# EAGLE design Applied-Procrastination-Fetch-Driver-Circuit-v1r2 (EAGLE 9.2.2)
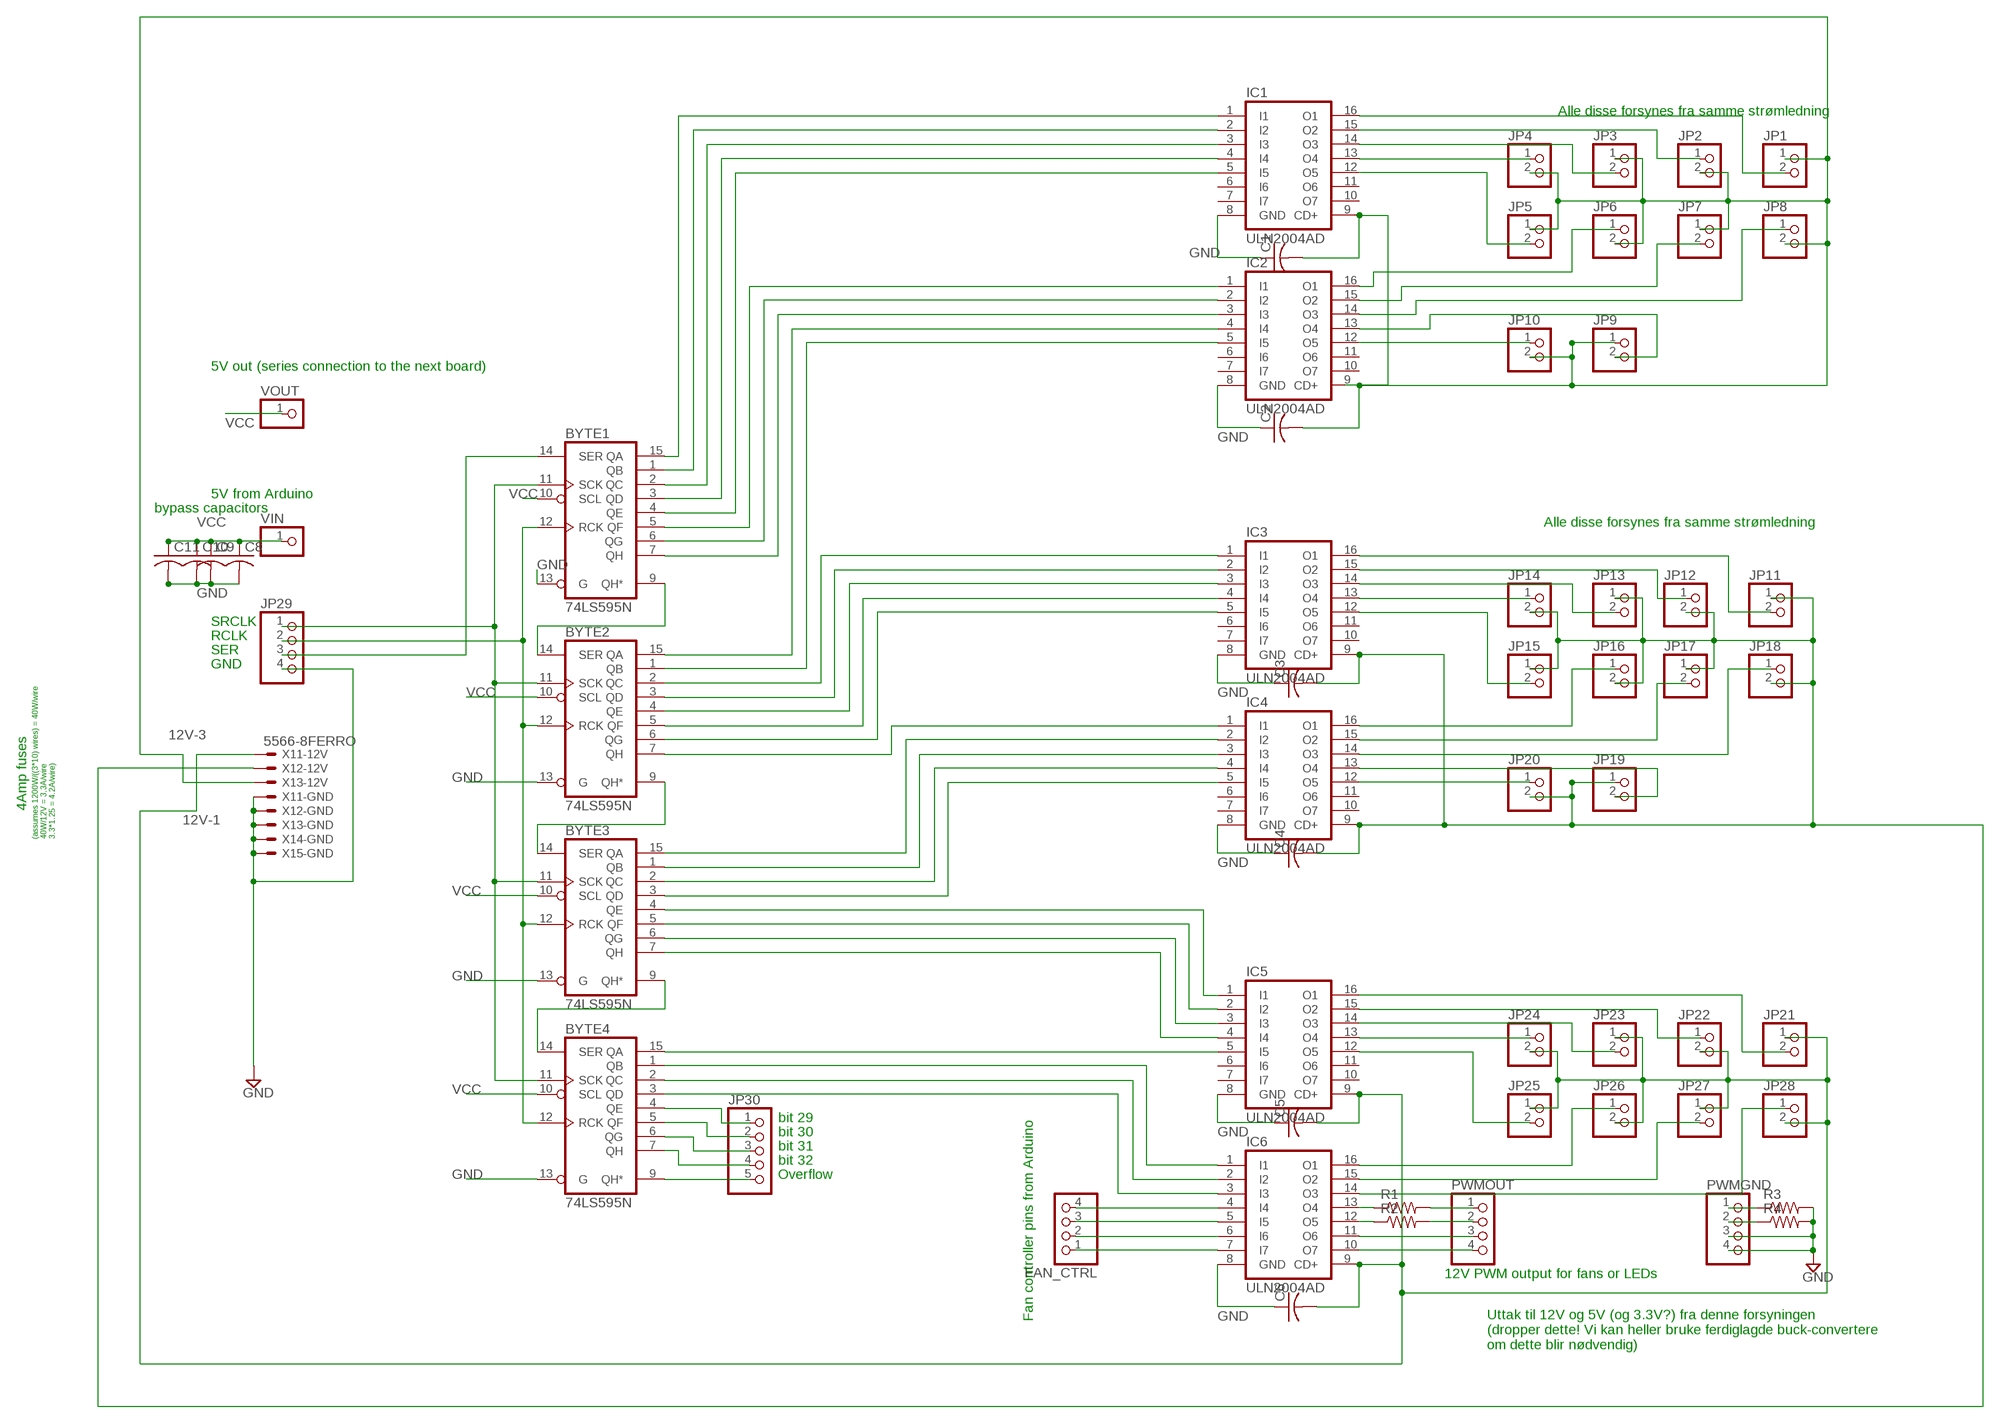
[diagram p0: schematic, sheet 1]

## Parts
BYTE1  74LS595N  [DIL16]
BYTE2  74LS595N  [DIL16]
BYTE3  74LS595N  [DIL16]
BYTE4  74LS595N  [DIL16]
C1  C-USC0603  [C0603]
C2  C-USC0603  [C0603]
C3  C-USC0603  [C0603]
C4  C-USC0603  [C0603]
C5  C-USC0603  [C0603]
C6  C-USC0603  [C0603]
C8  C-USC0603  [C0603]
C9  C-USC0603  [C0603]
C10  C-USC0603  [C0603]
C11  C-USC0603  [C0603]
FAN_CTRL  PINHD-1X4  [1X04]
IC1  ULN2004AD  [SO16]
IC2  ULN2004AD  [SO16]
IC3  ULN2004AD  [SO16]
IC4  ULN2004AD  [SO16]
IC5  ULN2004AD  [SO16]
IC6  ULN2004AD  [SO16]
JP1  PINHD-1X2SOLENOID-R  [SOLENOID-CONTACT-REVERSE]
JP2  PINHD-1X2SOLENOID  [SOLENOID-CONTACT]
JP3  PINHD-1X2SOLENOID-R  [SOLENOID-CONTACT-REVERSE]
JP4  PINHD-1X2SOLENOID  [SOLENOID-CONTACT]
JP5  PINHD-1X2SOLENOID-R  [SOLENOID-CONTACT-REVERSE]
JP6  PINHD-1X2SOLENOID  [SOLENOID-CONTACT]
JP7  PINHD-1X2SOLENOID-R  [SOLENOID-CONTACT-REVERSE]
JP8  PINHD-1X2SOLENOID  [SOLENOID-CONTACT]
JP9  PINHD-1X2SOLENOID-R  [SOLENOID-CONTACT-REVERSE]
JP10  PINHD-1X2SOLENOID  [SOLENOID-CONTACT]
JP11  PINHD-1X2SOLENOID-R  [SOLENOID-CONTACT-REVERSE]
JP12  PINHD-1X2SOLENOID  [SOLENOID-CONTACT]
JP13  PINHD-1X2SOLENOID-R  [SOLENOID-CONTACT-REVERSE]
JP14  PINHD-1X2SOLENOID  [SOLENOID-CONTACT]
JP15  PINHD-1X2SOLENOID-R  [SOLENOID-CONTACT-REVERSE]
JP16  PINHD-1X2SOLENOID  [SOLENOID-CONTACT]
JP17  PINHD-1X2SOLENOID-R  [SOLENOID-CONTACT-REVERSE]
JP18  PINHD-1X2SOLENOID  [SOLENOID-CONTACT]
JP19  PINHD-1X2SOLENOID-R  [SOLENOID-CONTACT-REVERSE]
JP20  PINHD-1X2SOLENOID  [SOLENOID-CONTACT]
JP21  PINHD-1X2SOLENOID-R  [SOLENOID-CONTACT-REVERSE]
JP22  PINHD-1X2SOLENOID  [SOLENOID-CONTACT]
JP23  PINHD-1X2SOLENOID-R  [SOLENOID-CONTACT-REVERSE]
JP24  PINHD-1X2SOLENOID  [SOLENOID-CONTACT]
JP25  PINHD-1X2SOLENOID-R  [SOLENOID-CONTACT-REVERSE]
JP26  PINHD-1X2SOLENOID  [SOLENOID-CONTACT]
JP27  PINHD-1X2SOLENOID-R  [SOLENOID-CONTACT-REVERSE]
JP28  PINHD-1X2SOLENOID  [SOLENOID-CONTACT]
JP29  PINHD-1X4  [1X04]
JP30  PINHD-1X5  [1X05]
PWMGND  PINHD-1X4  [1X04]
PWMOUT  PINHD-1X4  [1X04]
R1  R-US_R0603  [R0603]
R2  R-US_R0603  [R0603]
R3  R-US_R0603  [R0603]
R4  R-US_R0603  [R0603]
VIN  PINHD-1X1  [1X01]
VOUT  PINHD-1X1  [1X01]
X1  5566-8FERRO  [5566-8-CLEAN]

## Nets
12V-1: C5.2 C6.2 IC5.9(CD+) IC6.9(CD+) JP21.1 JP22.2 JP23.1 JP24.2 JP25.1 JP26.2 JP27.1 JP28.2 X1.1
12V-2: C3.2 C4.2 IC3.9(CD+) IC4.9(CD+) JP11.1 JP12.2 JP13.1 JP14.2 JP15.1 JP16.2 JP17.1 JP18.2 JP19.1 JP20.2 X1.2
12V-3: C1.2 C2.2 IC1.9(CD+) IC2.9(CD+) JP1.1 JP2.2 JP3.1 JP4.2 JP5.1 JP6.2 JP7.1 JP8.2 JP9.1 JP10.2 X1.3
GND: BYTE1.13(G) BYTE2.13(G) BYTE3.13(G) BYTE4.13(G) C1.1 C2.1 C3.1 C4.1 C5.1 C6.1 C8.2 C9.2 C10.2 C11.2 IC1.8(GND) IC2.8(GND) IC3.8(GND) IC4.8(GND) IC5.8(GND) IC6.8(GND) JP29.4 PWMGND.3 PWMGND.4 R3.2 R4.2 X1.4 X1.5 X1.6 X1.7 X1.8
N$1: BYTE1.11(SCK) BYTE2.11(SCK) BYTE3.11(SCK) BYTE4.11(SCK) JP29.1
N$2: FAN_CTRL.4 IC6.4(I4)
N$3: FAN_CTRL.3 IC6.5(I5)
N$4: FAN_CTRL.2 IC6.6(I6)
N$5: BYTE1.12(RCK) BYTE2.12(RCK) BYTE3.12(RCK) BYTE4.12(RCK) JP29.2
N$6: BYTE1.14(SER) JP29.3
N$7: BYTE1.9(QH*) BYTE2.14(SER)
N$8: BYTE2.9(QH*) BYTE3.14(SER)
N$9: BYTE3.9(QH*) BYTE4.14(SER)
N$10: BYTE1.15(QA) IC1.1(I1)
N$11: BYTE1.1(QB) IC1.2(I2)
N$12: BYTE1.2(QC) IC1.3(I3)
N$13: BYTE1.3(QD) IC1.4(I4)
N$14: BYTE1.4(QE) IC1.5(I5)
N$15: BYTE1.5(QF) IC2.1(I1)
N$16: BYTE1.6(QG) IC2.2(I2)
N$17: BYTE1.7(QH) IC2.3(I3)
N$18: BYTE2.15(QA) IC2.4(I4)
N$19: BYTE2.1(QB) IC2.5(I5)
N$20: BYTE2.2(QC) IC3.1(I1)
N$21: BYTE2.3(QD) IC3.2(I2)
N$22: BYTE2.4(QE) IC3.3(I3)
N$23: BYTE2.5(QF) IC3.4(I4)
N$24: BYTE2.6(QG) IC3.5(I5)
N$25: BYTE2.7(QH) IC4.1(I1)
N$26: BYTE3.15(QA) IC4.2(I2)
N$27: BYTE3.1(QB) IC4.3(I3)
N$28: BYTE3.2(QC) IC4.4(I4)
N$29: BYTE3.3(QD) IC4.5(I5)
N$30: BYTE3.4(QE) IC5.1(I1)
N$31: BYTE3.5(QF) IC5.2(I2)
N$32: BYTE3.6(QG) IC5.3(I3)
N$33: BYTE3.7(QH) IC5.4(I4)
N$34: BYTE4.15(QA) IC5.5(I5)
N$35: BYTE4.1(QB) IC6.1(I1)
N$36: BYTE4.2(QC) IC6.2(I2)
N$37: BYTE4.3(QD) IC6.3(I3)
N$38: BYTE4.4(QE) JP30.1
N$39: BYTE4.5(QF) JP30.2
N$40: BYTE4.6(QG) JP30.3
N$41: BYTE4.7(QH) JP30.4
N$42: BYTE4.9(QH*) JP30.5
N$43: IC1.13(O4) JP4.1
N$44: IC1.14(O3) JP3.2
N$45: IC1.15(O2) JP2.1
N$46: IC1.16(O1) JP1.2
N$47: IC1.12(O5) JP5.2
N$48: IC2.16(O1) JP6.1
N$49: IC2.15(O2) JP7.2
N$50: IC2.14(O3) JP8.1
N$51: IC2.13(O4) JP9.2
N$52: IC3.16(O1) JP11.2
N$53: IC3.13(O4) JP14.1
N$54: IC2.12(O5) JP10.1
N$55: IC3.15(O2) JP12.1
N$56: IC3.14(O3) JP13.2
N$57: IC3.12(O5) JP15.2
N$58: IC4.16(O1) JP16.1
N$59: IC4.15(O2) JP17.2
N$60: IC4.14(O3) JP18.1
N$61: IC4.13(O4) JP19.2
N$62: IC4.12(O5) JP20.1
N$63: IC5.13(O4) JP24.1
N$64: IC5.16(O1) JP21.2
N$65: IC5.15(O2) JP22.1
N$66: IC5.14(O3) JP23.2
N$67: IC5.12(O5) JP25.2
N$68: IC6.16(O1) JP26.1
N$69: IC6.15(O2) JP27.2
N$70: IC6.14(O3) JP28.1
N$71: FAN_CTRL.1 IC6.7(I7)
N$72: PWMOUT.1 R1.2
N$73: PWMOUT.2 R2.2
N$74: IC6.11(O6) PWMOUT.3
N$75: IC6.10(O7) PWMOUT.4
N$76: PWMGND.1 R3.1
N$77: PWMGND.2 R4.1
N$80: IC6.13(O4) R1.1
N$81: IC6.12(O5) R2.1
VCC: BYTE1.10(SCL) BYTE2.10(SCL) BYTE3.10(SCL) BYTE4.10(SCL) C8.1 C9.1 C10.1 C11.1 VIN.1 VOUT.1
Unconnected: IC1.6(I6) IC1.7(I7) IC1.10(O7) IC1.11(O6) IC2.6(I6) IC2.7(I7) IC2.10(O7) IC2.11(O6) IC3.6(I6) IC3.7(I7) IC3.10(O7) IC3.11(O6) IC4.6(I6) IC4.7(I7) IC4.10(O7) IC4.11(O6) IC5.6(I6) IC5.7(I7) IC5.10(O7) IC5.11(O6)

## Notes on the sheet
- Alle disse forsynes fra samme strømledning
- 5V out (series connection to the next board)
- 5V from Arduino
- bypass capacitors
- Alle disse forsynes fra samme strømledning
- SRCLK
- RCLK
- SER
- GND
- 4Amp fuses
- (assumes 1200W/((3*10) wires) = 40W/wire
  40W/12V = 3.3A/wire
  3.3*1.25 = 4.2A/wire)
- bit 29
- bit 30
- bit 31
- bit 32
- Overflow
- 12V PWM output for fans or LEDs
- Fan controller pins from Arduino
- Uttak til 12V og 5V (og 3.3V?) fra denne forsyningen 
  (dropper dette! Vi kan heller bruke ferdiglagde buck-convertere 
  om dette blir nødvendig)

## Power pins joined to a net without a drawn wire
GND: BYTE1.8(GND) BYTE2.8(GND) BYTE3.8(GND) BYTE4.8(GND)
VCC: BYTE1.16(VCC) BYTE2.16(VCC) BYTE3.16(VCC) BYTE4.16(VCC)

## Library data of the parts
BYTE1-BYTE4 = 74xx-us:74*595: 8-bit SHIFT REGISTER, output latch
C1-C6 C8-C11 = resistor:C-US: CAPACITOR, American symbol
FAN_CTRL JP29 PWMGND PWMOUT = pinhead-custom:PINHD-1X4: PIN HEADER
IC1-IC6 = uln-udn-custom:ULN2004A: DRIVER ARRAY
JP1-JP28 = pinhead-custom:PINHD-1X2: PIN HEADER
JP30 = pinhead:PINHD-1X5: PIN HEADER
R1-R4 = resistor:R-US_: RESISTOR, American symbol
VIN VOUT = pinhead-custom:PINHD-1X1: PIN HEADER
X1 = con-molex-custom:5566-8: Mini FIT connector 8 pol Source: http://www.molex.com

## Board
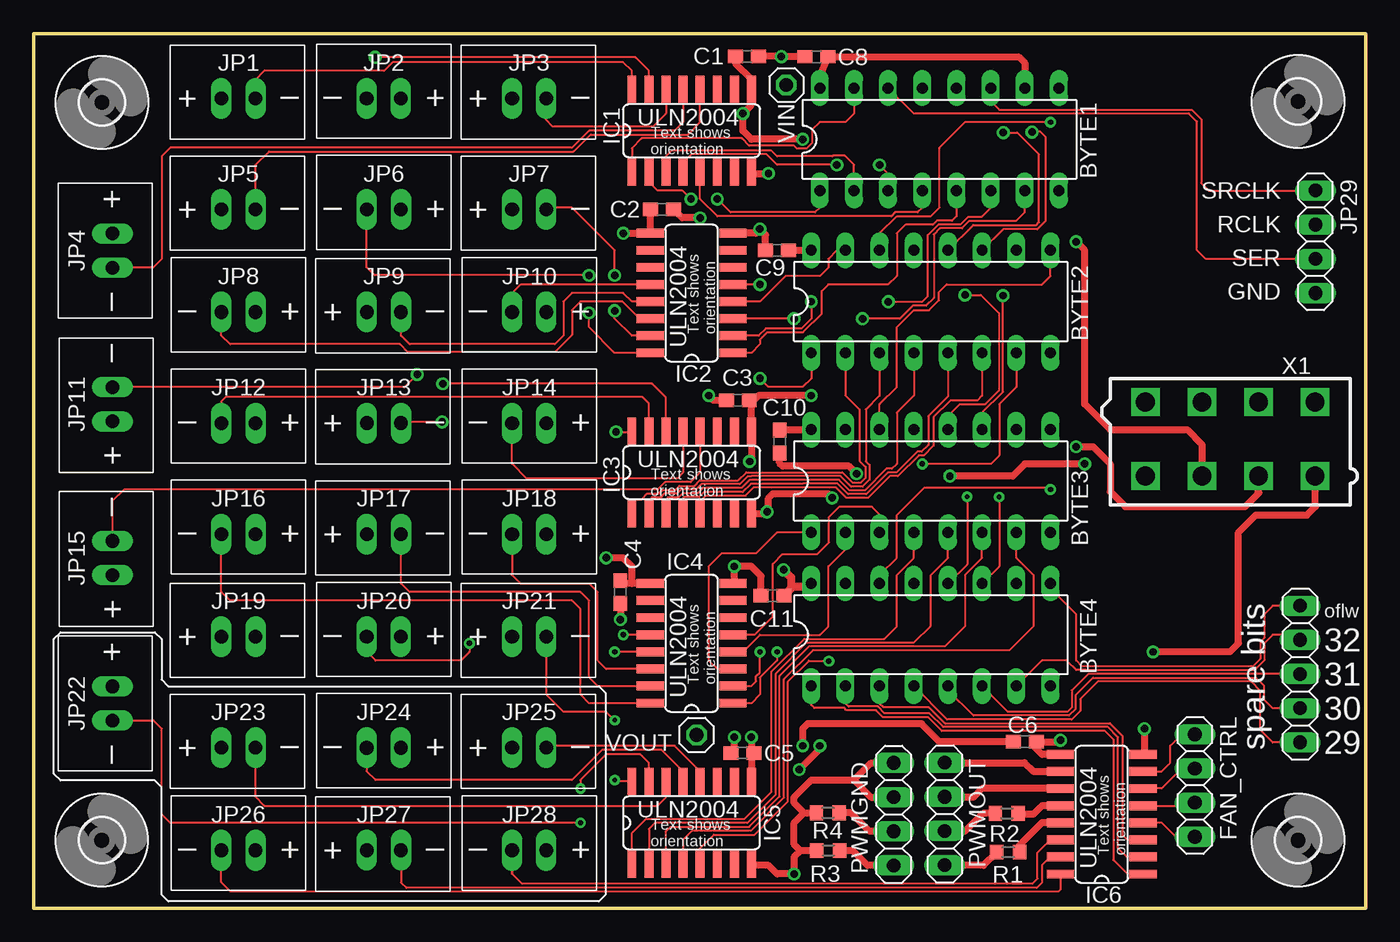
[diagram p1: board, top side]
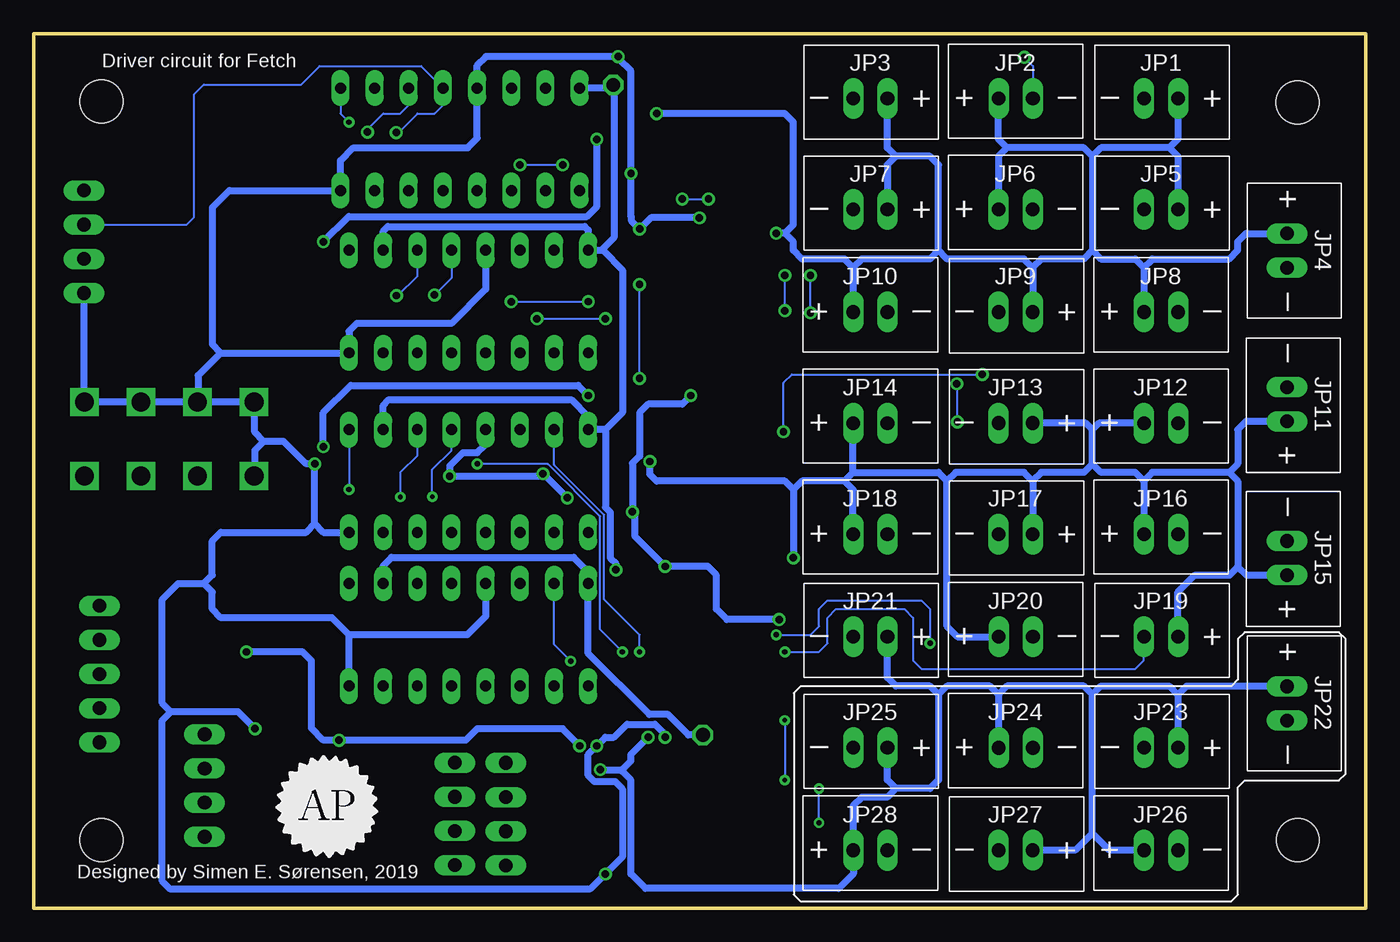
[diagram p2: board, bottom side, seen from below]

Size 99 x 65 mm. Coordinates in mm from the lower left corner, seen from the top.
Outline: 0,0 99,0 99,65 0,65 0,0
Copper layers (1*16): Top 0.035mm / dielectric 1.5mm / Bottom 0.035mm
Design rules "default *": minimum track width 5mil, minimum drill 0.35mm, track to track 5mil, track to pad 5mil, pad to pad 5mil, via to via 5mil, smd to smd 5mil, copper to edge 40mil, drill to drill 6mil, minimum pad ring 10mil, minimum via ring 8mil, stop-mask expansion 4mil, vias tented up to drill 0mil, thermal gap 10mil

### Footprints (pad centres in the part's own frame; a part is rotated, then mirrored left to right if it is on the bottom)
DIL16 = drill 0.813 long: 1 -8.89,-3.81; 2 -6.35,-3.81; 3 -3.81,-3.81; 4 -1.27,-3.81; 5 1.27,-3.81; 6 3.81,-3.81; 7 6.35,-3.81; 8 8.89,-3.81; 9 8.89,3.81; 10 6.35,3.81; 11 3.81,3.81; 12 1.27,3.81; 13 -1.27,3.81; 14 -3.81,3.81; 15 -6.35,3.81; 16 -8.89,3.81
C0603 = smd 1.1 x 1: 1 -0.85,0; 2 0.85,0
1X04 = drill 1.016 long: 1 -3.81,0; 2 -1.27,0; 3 1.27,0; 4 3.81,0
SO16 = smd 0.66 x 2.032: 1 -4.445,-3.073; 2 -3.175,-3.073; 3 -1.905,-3.073; 4 -0.635,-3.073; 5 0.635,-3.073; 6 1.905,-3.073; 7 3.175,-3.073; 8 4.445,-3.073; 9 4.445,3.073; 10 3.175,3.073; 11 1.905,3.073; 12 0.635,3.073; 13 -0.635,3.073; 14 -1.905,3.073; 15 -3.175,3.073; 16 -4.445,3.073
SOLENOID-CONTACT-REVERSE = drill 1.016 long: 1 3.8,3.035; 2 6.34,3.035
SOLENOID-CONTACT = drill 1.016 long: 1 3.788,3.031; 2 6.328,3.031
1X05 = drill 1.016 long: 1 -5.08,0; 2 -2.54,0; 3 0,0; 4 2.54,0; 5 5.08,0
R0603 = smd 1 x 1.1: 1 -0.85,0; 2 0.85,0
3,2 = hole 3.2: 0,0
1X01 = drill 1.016 octagon: 1 0,0
5566-8-CLEAN = drill 1.4 square: 1 6.325,-3.436; 2 2.125,-3.436; 3 -2.075,-3.436; 4 -6.275,-3.436; 5 6.325,2.064; 6 2.125,2.064; 7 -2.075,2.064; 8 -6.275,2.064

### Placement (x,y rotation side)
BYTE1  67.31,57.15 0 top
BYTE2  66.67,45.09 0 top
BYTE3  66.67,31.75 0 top
BYTE4  66.67,20.32 0 top
C1  53.02,63.32 180 top
C2  46.7,51.94 180 top
C3  52.33,37.74 0 top
C4  43.59,23.49 90 top
C5  52.67,11.54 0 top
C6  73.66,12.37 0 top
C8  58.18,63.28 180 top
C9  55.24,48.9 180 top
C10  55.44,34.69 270 top
C11  54.9,23.23 180 top
FAN_CTRL  86.3,9.11 270 top
IC1  48.9,57.78 0 top
IC2  48.9,45.72 90 top
IC3  48.9,32.38 0 top
IC4  48.9,19.68 90 top
IC5  48.9,6.35 0 top
IC6  79.38,6.99 90 top
JP1  10.15,57.15 0 top
JP2  20.95,57.15 0 top
JP3  31.75,57.15 0 top
JP4  8.89,43.81 90 top
JP5  10.15,48.9 0 top
JP6  20.97,48.9 0 top
JP7  31.75,48.9 0 top
JP8  10.16,41.27 0 top
JP9  20.95,41.27 0 top
JP10  31.76,41.27 0 top
JP11  8.89,32.38 90 top
JP12  10.16,33.02 0 top
JP13  20.95,33.02 0 top
JP14  31.76,33.02 0 top
JP15  8.89,20.95 90 top
JP16  10.16,24.77 0 top
JP17  20.95,24.77 0 top
JP18  31.76,24.77 0 top
JP19  10.15,17.14 0 top
JP20  20.95,17.14 0 top
JP21  31.75,17.14 0 top
JP22  8.89,10.16 90 top
JP23  10.15,8.89 0 top
JP24  20.95,8.89 0 top
JP25  31.75,8.89 0 top
JP26  10.16,1.27 0 top
JP27  20.95,1.27 0 top
JP28  31.76,1.27 0 top
JP29  95.25,49.53 270 top
JP30  94.11,17.4 90 top
PWMGND  63.91,6.99 90 top
PWMOUT  67.71,7 90 top
R1  72.42,4.17 180 top
R2  72.32,7.04 180 top
R3  59.05,4.28 180 top
R4  59.02,7.09 180 top
U$1  [3,2]  5.06,5.05 0 top
U$2  [3,2]  93.97,5.05 0 top
U$3  [3,2]  93.95,59.96 0 top
U$5  [3,2]  5.08,59.88 0 top
VIN  55.94,61.18 0 top
VOUT  49.26,12.88 90 top
X1  88.9,35.56 0 top

### Tracks (layer width: path | path; a pad name or v marks a point on that pad's centre or on a via)
12V-1  (via drill 0.55)
  Top 0.508: v53.34,12.7 53.34,11.72 C5.2 53.33,11.34 53.33,9.44 IC5.9 | v56.89,10.3 58.42,11.83 v58.42,12.06 | IC6.9 74.93,11.43 74.3,12.06 74.3,12.15 C6.2 76.2,12.37 v76.31,12.48 | v83.19,19.05 88.9,19.05 89.53,19.68 89.53,27.94 90.81,29.21 94.61,29.21 95.25,29.84 95.22,29.87 X1.1
  Bottom 0.508: JP27.1 21.59,4.3 20.32,5.58 | 20.32,5.58 20.32,15.88 | 20.32,15.88 20.95,16.51 26.67,16.51 27.3,15.88 | 31.75,15.88 31.11,16.51 27.94,16.51 27.3,15.88 | 31.75,15.88 31.75,9.53 32.38,8.89 34.92,8.89 | 34.92,8.89 35.56,9.53 35.55,9.54 JP25.1 | 34.92,8.89 35.56,8.26 37.47,8.26 38.1,7.62 JP28.2 38.09,2.55 39.17,1.47 53.54,1.47 54.61,2.54 54.61,9.53 55.24,10.16 55.24,10.29 55.26,10.3 | 27.3,15.88 27.3,11.94 JP24.2 | 20.32,15.88 19.68,16.51 14.61,16.51 13.96,15.87 | 13.96,15.87 JP23.1 | 13.96,15.87 13.34,16.49 13.34,16.51 5.88,16.51 JP22.2 | 31.75,15.88 32.38,16.51 34.92,16.51 35.56,17.14 JP21.1 | v53.34,12.7 54.61,11.43 54.61,10.95 55.26,10.3 | v56.89,10.3 55.26,10.3 | v58.42,12.06 59.69,13.34 66.04,13.34 66.9,12.48 v76.31,12.48 77.47,12.48 78.36,13.37 78.36,18.38 79.05,19.07 83.16,19.07 v83.19,19.05 | JP26.2 19.05,4.3 20.32,5.58
12V-2  (via drill 0.55)
  Top 0.508: v53.2,33.2 53.34,33.34 IC3.9 53.34,37.59 | C4.2 43.8,24.13 44.45,24.13 | IC4.9 44.45,24.13 | 44.45,24.13 44.45,25.4 43.81,26.04 v42.55,26.04 | 53.34,37.59 C3.2 | v57.78,38.1 53.85,38.1 53.34,37.59 | v77.47,34.29 78.74,34.29 80.01,33.02 80.01,30.96 81.12,29.84 90.02,29.84 91.05,30.87 91.03,30.89 X1.2
  Bottom 0.508: JP11.1 8.88,36.19 8.89,36.2 9.53,35.56 9.53,33.02 10.16,32.38 | 10.16,32.38 9.53,31.75 9.53,25.4 9.5,25.38 | JP15.1 8.88,24.75 9.5,25.38 | 10.16,32.38 15.88,32.38 16.51,31.75 | 16.51,31.75 16.49,31.73 JP16.2 | JP16.2 | 16.51,31.75 17.14,32.38 19.68,32.38 20.32,33.02 | 20.32,33.02 20.32,35.56 | 20.32,35.56 20.82,36.05 JP13.1 | 20.32,33.02 20.95,32.38 24.13,32.38 24.77,31.75 | 24.77,31.75 24.75,31.74 JP17.1 | 24.77,31.75 25.4,32.38 30.48,32.38 31.11,31.75 | 31.11,31.75 31.75,32.38 38.1,32.38 | 38.1,36.03 38.08,36.05 | 38.1,27.82 38.1,31.11 38.73,31.75 | 38.1,27.82 38.08,27.8 | JP20.2 30.34,20.18 31.11,20.95 31.11,31.75 | JP19.1 13.96,22.85 13.97,22.86 13.97,23.5 12.7,24.77 10.12,24.77 9.5,25.38 | 42.55,31.11 41.91,31.75 38.73,31.75 | 42.55,31.11 v42.55,26.04 | 38.73,31.75 38.1,32.38 | 38.1,32.38 38.1,36.03 | 42.55,31.11 43.18,31.75 52.7,31.75 53.2,32.24 v53.2,33.2 | v77.47,34.29 77.47,36.83 75.44,38.86 58.54,38.86 v57.78,38.1 | JP14.2 38.1,36.03 | JP18.2 38.1,27.82 | 16.48,36.05 JP12.2 19.83,36.05 20.32,35.56 | JP16.2
12V-3  (via drill 0.55)
  Top 0.508: v43.81,50.16 IC2.9 45.82,51.92 C2.2 | C1.2 52.17,62.77 53.34,61.59 IC1.9 53.34,59.69 v52.7,59.05 52.7,57.78 53.34,57.15 v57.15,57.15 | v77.47,49.53 78.11,48.9 78.11,37.47 80.01,35.56 85.72,35.56 86.83,34.46 X1.3
  Bottom 0.508: 14.61,56.52 13.97,55.88 13.97,51.94 JP5.1 | 14.61,56.52 13.96,57.16 JP1.1 | 26.67,56.52 27.3,57.15 27.3,60.16 JP2.2 | 14.61,56.52 19.68,56.52 20.32,55.88 | 26.67,56.52 20.95,56.52 20.32,55.88 | 26.67,56.52 27.3,55.88 27.3,51.95 JP6.2 | JP6.2 | 20.32,55.88 20.32,48.9 | 20.32,48.9 19.68,48.26 17.14,48.26 16.49,47.6 | JP8.2 | 16.49,47.6 15.88,48.22 15.88,48.26 10.16,48.26 9.53,48.9 9.53,49.53 8.89,50.16 8.87,50.14 JP4.2 | 20.32,48.9 20.95,48.26 24.13,48.26 24.77,47.62 | 24.77,47.62 24.75,47.62 JP9.1 | 24.77,47.62 25.4,48.26 31.11,48.26 31.75,48.9 | 31.75,48.9 31.75,55.24 32.38,55.88 34.92,55.88 | 34.92,55.88 35.56,55.24 35.55,55.23 JP7.1 | 34.92,55.88 35.56,56.52 35.56,60.17 JP3.1 | 31.75,48.9 32.38,48.26 37.47,48.26 38.1,47.62 | 38.1,47.62 38.1,44.33 38.08,44.31 JP10.2 | 38.1,47.62 38.73,48.26 41.91,48.26 42.55,48.9 42.55,49.53 43.18,50.16 | 43.18,50.16 42.55,50.8 42.55,58.42 43.18,59.05 v52.7,59.05 | 43.18,50.16 v43.81,50.16 | v77.47,49.53 75.59,51.41 57.89,51.41 57.15,52.15 v57.15,57.15 | JP6.2 | 16.49,47.6 JP8.2 | JP8.2
GND  (via drill 0.55)
  Top 0.508: v78.11,33.02 v78.11,33.01 73.65,33.01 72.76,32.12 v68.09,32.12 | C5.1 52.07,11.79 v52.07,12.7 | C6.1 67.31,12.37 65.98,13.7 57.52,13.7 57.15,13.34 v57.15,12.06 | IC5.8 53.44,3.17 54.61,3.17 55.24,2.54 v56.52,2.54 56.52,3.81 56.98,4.28 | C4.1 v43.6,21.45 | C11.2 54.05,24.69 53.34,25.4 v52.07,25.4 52.07,24.23 IC4.8 | C3.1 50.52,37.74 v50.16,38.1 | C9.2 54.4,50.05 v53.96,50.48 53.65,50.16 IC2.8 | v49.53,51.31 48.18,51.31 C2.1 | C1.1 55.54,63.32 v55.56,63.29 C8.2 | v82.55,13.34 82.55,11.53 IC6.8 | R3.2 56.98,4.28 | 56.98,4.28 56.52,4.75 56.52,6.35 57.25,7.09 | 57.25,7.09 R4.2 | 57.25,7.09 56.52,7.82 56.52,8.26 57.78,9.53 60.96,9.53 | 60.96,9.53 62.23,8.26 PWMGND.3 | 60.96,9.53 62.23,10.79 PWMGND.4 | IC3.8 54.34,29.3 v54.5,29.46 54.61,29.57 54.61,30.48 54.93,30.8 59.04,30.8 v59.34,30.5 | v61.15,32.29 v61.15,32.3 60.59,32.86 55.67,32.86 55.44,33.1 C10.2 | IC1.8 53.44,54.61 v54.61,54.61
  Bottom 0.508: 85.09,41.27 BYTE2.8 75.56,42.88 74.98,43.46 67.95,43.46 65.41,46.01 BYTE2.13 | 85.09,41.27 85.72,41.91 85.72,52.07 84.45,53.34 BYTE1.8 76.2,55.56 75.25,56.52 66.75,56.52 66.04,57.23 BYTE1.13 66.04,62.63 65.39,63.29 v55.56,63.29 55.56,63.18 54.61,62.23 v54.61,54.61 54.61,51.44 54.6,51.42 54.6,51.12 v53.96,50.48 53.14,51.31 v49.53,51.31 | BYTE3.8 77.47,27.94 78.11,28.57 | v52.07,12.7 52.07,12.92 52.83,13.68 54.9,13.68 55.88,12.7 56.52,12.7 v57.15,12.06 57.78,11.43 57.78,9.86 57.32,9.39 55.78,9.39 55.24,8.86 55.24,3.81 v56.52,2.54 57.6,1.45 88.89,1.45 89.44,2 89.44,13.97 88.81,14.61 | v43.6,21.45 47.48,21.45 48.26,22.23 48.26,24.77 48.9,25.4 v52.07,25.4 54.34,27.67 54.34,29.3 v54.5,29.46 54.5,33.07 53.98,33.6 53.98,36.83 53.34,37.47 50.8,37.47 v50.16,38.1 | BYTE4.8 75.56,20.32 | 75.56,20.32 76.83,21.59 85.09,21.59 85.72,22.23 85.72,23.5 86.36,24.13 | 86.36,24.13 88.27,24.13 89.44,22.95 89.44,15.24 88.81,14.61 | v82.55,13.34 83.82,14.61 88.81,14.61 | v59.34,30.5 61.15,32.31 v61.15,32.29 61.32,32.12 v68.09,32.12 68.09,32.88 67.1,33.86 66.03,33.86 65.47,34.43 65.44,34.43 65.44,35.53 BYTE3.13 | 85.09,41.27 86.78,39.59 86.78,37.67 X1.7 | 81.89,34.7 80.42,34.7 78.74,33.02 v78.11,33.02 78.11,28.57 | 81.89,34.7 82.58,35.39 82.58,37.57 X1.8 X1.7 | 78.11,28.57 78.74,27.94 85.09,27.94 85.72,27.3 85.72,24.77 86.36,24.13 | X1.4 82.55,32.2 82.55,34.04 81.89,34.7 | X1.7 X1.6 X1.5 95.22,45.7 JP29.4 | BYTE4.13 65.41,21.7 66.78,20.32 75.56,20.32
N$1  (via drill 0.35, 0.55)
  Top 0.152: JP29.1 87.34,53.34 86.77,53.91 86.77,58.64 86.07,59.33 71.75,59.33 71.12,59.97 BYTE1.11 | BYTE3.11 70.48,36.83 72.03,38.38 v72.03,45.53 | BYTE2.11 72.05,50.46 74.59,50.46 75.18,51.05 75.18,57.33 74.77,57.74 74.25,57.74 v74.19,57.68 | v71.75,30.56 71.75,25.4 BYTE4.11
  Bottom 0.152: v71.75,30.56 71.75,32.38 70.48,33.66 BYTE3.11 | BYTE2.11 70.48,46.99 71.95,45.53 v72.03,45.53 | BYTE1.11 71.12,59.69 71.75,59.05 73.03,59.05 74.19,57.89 v74.19,57.68
N$2
  Top 0.152: FAN_CTRL.4 84.87,5.3 83.82,6.35 IC6.4
N$3
  Top 0.152: IC6.5 86.07,7.62 FAN_CTRL.3
N$4
  Top 0.152: FAN_CTRL.2 86.07,10.16 85.09,10.16 83.82,8.89 IC6.6
N$5  (via drill 0.35, 0.55)
  Top 0.152: BYTE3.12 67.94,36.56 68.85,37.47 70.72,37.47 71.75,38.49 71.75,44.21 70.39,45.58 v69.22,45.58 | BYTE2.12 69.83,50.78 74.52,50.78 74.71,50.97 74.71,56.03 73.09,57.65 v72.06,57.65 | v69.37,30.58 69.37,25.56 BYTE4.12
  Bottom 0.152: BYTE3.12 67.94,34.03 69.37,32.6 v69.37,30.58 | BYTE2.12 67.94,46.85 v69.22,45.58 | v72.06,57.65 71.89,57.65 70.48,59.05 69.22,59.05 68.58,59.69 BYTE1.12 70.21,62.59 77.75,62.59 79.12,61.21 86.36,61.21 87.08,60.5 87.08,51.35 87.63,50.8 JP29.2
N$6
  Top 0.152: BYTE1.14 65.41,59.05 85.85,59.05 86.45,58.46 86.45,48.91 87.1,48.26 JP29.3
N$7  (via drill 0.4)
  Top 0.152: BYTE2.14 62.87,50.16 64.14,51.44 66.67,51.44 67.31,52.07 67.31,56.52 69.22,58.42 v75.56,58.42
  Bottom 0.152: BYTE1.9 76.2,59.05 v75.56,58.42
N$8
  Top 0.152: BYTE3.14 62.87,37.47 64.14,38.73 64.14,43.18 65.41,44.45 66.54,44.45 67.28,45.19 67.28,45.8 67.84,46.35 74.93,46.35 75.56,46.99 BYTE2.9
N$9  (via drill 0.4)
  Top 0.152: BYTE4.14 62.87,24.77 64.14,26.04 64.14,29.21 66.16,31.24 75.44,31.24 v75.56,31.11
  Bottom 0.152: BYTE3.9 v75.56,31.11
N$10
  Top 0.152: BYTE1.15 60.96,59.05 60.33,58.42 58.42,58.42 57.85,57.85 57.85,56.88 57.44,56.46 56.71,56.46 56.51,56.67 53.18,56.67 52.62,57.22 45.19,57.22 44.45,56.48 IC1.1
N$11  (via drill 0.55)
  Top 0.152: BYTE1.1 58.42,52.07 58.06,51.71 51.79,51.71 v50.8,52.7 | v48.85,52.7 48.21,53.34 46.35,53.34 45.72,53.98 IC1.2
  Bottom 0.152: v50.8,52.7 v48.85,52.7
N$12
  Top 0.152: BYTE1.2 60.96,55.24 60.28,55.93 59.41,55.93 59.36,55.88 55.24,55.88 54.82,56.3 47.41,56.3 46.99,55.88 IC1.3
N$13  (via drill 0.55)
  Top 0.152: BYTE1.3 63.5,54.61 v62.87,55.24 | v59.69,55.24 55.24,55.24 54.46,56.03 48.9,56.03 48.26,55.39 IC1.4
  Bottom 0.152: v62.87,55.24 v59.69,55.24
N$14
  Top 0.152: BYTE1.4 66.04,52.07 65.68,51.71 64.02,51.71 63.74,51.44 50.8,51.44 49.53,52.7 IC1.5
N$15
  Top 0.152: BYTE1.5 68.58,51.44 68.24,51.1 67.12,51.1 66.83,50.8 64.77,50.8 64.14,50.16 64.14,46.99 63.5,46.35 59.05,46.35 58.57,45.88 58.57,44.21 57.17,42.8 54.52,42.8 53.98,42.26 53.98,41.91 53.34,41.27 IC2.1
N$16  (via drill 0.55)
  Top 0.152: BYTE1.6 71.12,52.07 70.43,51.38 69.43,51.38 68.87,50.82 67.24,50.82 66.45,50.03 66.45,45.48 66.05,45.09 63.52,45.09 v63.51,45.07 | v57.78,45.09 57.78,43.81 57.05,43.09 54.41,43.09 53.87,42.55 IC2.2
  Bottom 0.152: v57.78,45.09 57.8,45.07 v63.51,45.07
N$17  (via drill 0.55)
  Top 0.152: v61.59,43.81 v61.6,43.81 64.37,43.81 65.33,44.77 66.32,44.77 66.89,45.34 66.89,50.08 67.35,50.54 68.99,50.54 69.55,51.1 73.03,51.1 73.66,51.73 BYTE1.7 | v56.52,43.81 IC2.3
  Bottom 0.152: v61.59,43.81 v56.52,43.81
N$18
  Top 0.152: BYTE2.15 59.69,48.9 59.05,48.26 59.05,47.62 58.42,46.99 55.88,46.99 53.98,45.09 IC2.4
N$19  (via drill 0.55)
  Top 0.152: BYTE2.1 57.78,39.37 57.15,38.73 54.61,38.73 v53.98,39.37 | v53.98,46.35 IC2.5
  Bottom 0.152: v53.98,39.37 v53.98,46.35
N$20
  Top 0.152: IC3.1 44.45,30.3 44.54,30.39 45.17,30.39 45.58,30.8 46.45,30.8 46.74,31.09 47.68,31.09 47.99,31.39 49.11,31.39 49.5,31.79 52.36,31.79 52.95,32.38 60.09,32.38 60.87,31.61 61.45,31.61 61.83,31.99 61.83,32.8 61.37,33.25 61.37,37.07 60.33,38.12 BYTE2.2
N$21
  Top 0.152: BYTE2.3 62.87,38.1 61.84,37.08 61.84,33.22 62.12,32.94 62.12,31.85 61.59,31.33 60.74,31.33 59.97,32.11 53.34,32.11 53.33,32.1 53.06,32.1 52.47,31.51 49.62,31.51 49.22,31.12 48.1,31.12 47.8,30.81 46.85,30.81 46.57,30.52 45.94,30.52 45.72,30.31 IC3.2
N$22
  Top 0.152: BYTE2.4 65.41,38.1 64.14,36.83 64.14,33.02 63.78,32.66 63.38,32.66 61.77,31.05 60.63,31.05 59.85,31.83 53.98,31.83 53.97,31.82 53.18,31.82 52.59,31.23 49.73,31.23 49.34,30.84 48.22,30.84 47.92,30.53 47.14,30.53 46.99,30.39 IC3.3
N$23
  Top 0.152: BYTE2.5 67.94,38.03 66.48,36.57 66.48,34.44 65.98,33.93 65.66,33.93 64.11,32.38 63.5,32.38 61.89,30.77 60.51,30.77 59.74,31.55 57.16,31.55 57.15,31.54 53.3,31.54 52.69,30.93 49.83,30.93 49.45,30.56 48.34,30.56 48.26,30.48 IC3.4
N$24
  Top 0.152: BYTE2.6 70.48,38.1 70.13,37.74 68.13,37.74 66.88,36.49 66.88,34.37 66.16,33.66 65.77,33.66 64.22,32.11 63.62,32.11 62,30.49 60.4,30.49 59.63,31.26 53.49,31.26 52.91,30.68 52.91,30.65 49.94,30.65 49.53,30.24 IC3.5
N$25  (via drill 0.4)
  Top 0.152: BYTE2.7 73.03,38.73 71.75,37.47 71.75,33.66 71.12,33.02 v66.04,33.02 | v55.24,19.05 55.24,18.41 53.98,17.14 53.98,15.88 53.34,15.24 IC4.1
  Bottom 0.152: v66.04,33.02 66.03,33.01 60.79,33.01 56.9,29.11 56.9,20.7 v55.24,19.05
N$26  (via drill 0.4)
  Top 0.152: IC4.2 53.34,16.51 53.7,16.87 53.7,17.26 53.98,17.54 v53.98,19.05
  Bottom 0.152: v53.98,19.05 53.98,20.32 56.61,22.95 56.61,29.24 60.33,32.96 BYTE3.15
N$27
  Top 0.152: BYTE3.1 55.24,27.94 53.67,26.36 51.13,26.36 50.16,25.4 50.16,18.41 50.8,17.78 IC4.3
N$28
  Top 0.152: IC4.4 52.7,19.05 53.98,20.32 58.42,20.32 59.05,20.95 59.05,25.4 60.33,26.67 BYTE3.2
N$29
  Top 0.152: IC4.5 53.56,20.32 54.93,21.69 54.93,25.6 55.65,26.31 58.24,26.31 59.12,27.19 59.12,29.09 59.85,29.82 62.3,29.82 62.87,29.26 BYTE3.3
N$30
  Top 0.152: IC5.1 44.45,5.59 45.51,6.65 52.83,6.65 54.83,8.64 54.83,17.58 57.27,20.03 63.21,20.03 64.14,20.95 64.14,24.77 65.41,26.04 BYTE3.4
N$31
  Top 0.152: IC5.2 45.72,5.88 46.18,6.34 53.03,6.34 55.16,8.46 55.16,17.44 57.45,19.74 65.41,19.74 66.62,20.95 66.67,20.95 66.67,24.77 67.94,26.04 BYTE3.5
N$32
  Top 0.152: IC5.3 46.99,5.71 47.31,6.04 53.17,6.04 55.44,8.31 55.44,17.27 57.63,19.46 67.72,19.46 69.22,20.95 69.22,24.77 70.48,26.04 BYTE3.6
N$33
  Top 0.152: IC5.4 48.26,5.08 48.94,5.76 53.3,5.76 55.76,8.22 55.76,17.03 57.9,19.17 72.51,19.17 74.3,20.95 74.3,24.77 73.03,26.04 BYTE3.7
N$34  (via drill 0.4)
  Top 0.152: IC5.5 49.53,4.45 50.55,5.47 53.57,5.47 56.05,7.94 56.05,16.84 57.6,18.4 59.06,18.4 v59.09,18.36
  Bottom 0.152: v59.09,18.36 60.33,19.6 BYTE4.15
N$35
  Top 0.152: BYTE4.1 57.78,15.11 58.02,14.87 60.24,14.87 60.41,14.71 62.59,14.71 63.11,14.19 66.48,14.19 67.49,13.18 79.61,13.18 80.23,12.55 80.23,3.59 81.28,2.54 IC6.1
N$36
  Top 0.152: BYTE4.2 60.33,15.21 60.55,14.99 62.72,14.99 63.21,14.5 66.57,14.5 67.6,13.46 79.83,13.46 80.59,12.7 80.59,4.45 81.22,3.81 IC6.2
N$37
  Top 0.152: BYTE4.3 62.87,15.24 63.15,14.95 66.5,14.95 67.72,13.74 79.98,13.74 80.91,12.8 80.91,5.45 81.28,5.08 IC6.3
N$38
  Top 0.152: JP30.1 92.08,12.32 91.16,13.23 91.16,16.15 90.47,16.84 79.07,16.84 77.78,15.54 77.78,14.67 77.14,14.03 67.88,14.03 BYTE4.4
N$39
  Top 0.152: BYTE4.5 67.94,16.2 69.84,14.31 76.94,14.31 77.43,14.81 77.43,15.84 78.72,17.12 90.83,17.12 91.44,16.51 91.44,15.49 92.08,14.86 JP30.2
N$40
  Top 0.152: BYTE4.6 72.39,14.61 76.83,14.61 77.15,14.92 77.15,16.19 78.36,17.4 JP30.3
N$41
  Top 0.152: JP30.4 93.73,20.32 92.08,20.32 91.44,19.68 91.44,18.41 90.7,17.68 78.21,17.68 78.19,17.7 77.47,17.7 76.83,18.33 76.83,18.41 74.93,18.41 BYTE4.7
N$42
  Top 0.152: JP30.5 92.08,22.48 91.44,21.84 91.44,20.08 91.16,19.8 91.16,18.53 90.61,17.98 77.91,17.98 77.47,18.41 77.47,21.84 75.56,23.75 BYTE4.9
N$43
  Top 0.152: IC1.13 48.26,58.42 47.62,57.78 41.27,57.78 40.01,56.52 10.16,56.52 9.53,55.88 9.53,48.26 8.87,47.6 JP4.1
N$44
  Top 0.152: IC1.14 46.99,59.05 46.04,58.1 38.58,58.1 38.09,58.59 JP3.2
N$45  (via drill 0.55)
  Top 0.152: IC1.15 45.72,62.23 44.72,63.23 v25.39,63.23
  Bottom 0.152: v25.39,63.23 24.74,62.59 JP2.1
N$46
  Top 0.152: IC1.16 44.45,62.23 43.81,62.87 26.67,62.87 26.04,62.23 17.14,62.23 16.5,61.59 JP1.2
N$47
  Top 0.152: JP5.2 16.51,51.94 16.51,55.24 17.5,56.24 40.12,56.24 41.39,57.51 48.62,57.51 49.53,58.42 IC1.12
N$48  (via drill 0.55)
  Top 0.152: IC2.16 43.18,41.27 41.27,43.18 v41.27,44.25 | v41.27,47.04 25.35,47.04 24.74,47.65 JP6.1
  Bottom 0.152: v41.27,44.25 v41.27,47.04
N$49  (via drill 0.55)
  Top 0.152: IC2.15 44.45,42.55 43.18,43.81 v43.18,44.4 | v43.18,47.04 43.18,48.9 40.01,52.07 38.23,52.07 JP7.2
  Bottom 0.152: v43.18,44.4 v43.18,47.04
N$50
  Top 0.152: JP8.1 13.95,42.57 14.61,41.91 27.22,41.91 27.78,41.35 38.76,41.35 40.01,42.6 40.01,44.45 40.64,45.09 43.76,45.09 45.03,43.81 IC2.14
N$51
  Top 0.152: IC2.13 44.45,45.09 43.81,45.72 40.01,45.72 39.37,45.09 39.37,42.55 38.73,41.91 27.94,41.91 27.3,42.55 JP9.2
N$52  (via drill 0.55)
  Top 0.152: v43.27,35.41 44.5,35.41 IC3.16 | v28.5,39.67 27.56,38.73 JP11.2
  Bottom 0.152: v43.27,35.41 43.27,39.06 42.67,39.67 v28.5,39.67
N$53
  Top 0.152: IC3.13 48.26,32.38 47.83,31.95 36.63,31.95 35.54,33.04 35.54,36.05
N$54
  Top 0.152: IC2.12 36.2,46.35 35.54,45.7 35.54,44.31
N$55
  Top 0.152: IC3.15 45.72,37.5 45.24,37.98 14.27,37.98 13.95,37.66 JP12.1
N$56  (via drill 0.55)
  Top 0.152: v30.4,38.97 30.42,38.98 45.94,38.98 46.99,37.94 IC3.14 | v30.35,36.14 27.38,36.14 JP13.2
  Bottom 0.152: v30.4,38.97 30.4,36.2 v30.35,36.14
N$57
  Top 0.152: IC3.12 49.53,32.38 48.82,31.68 46.93,31.68 46.37,31.11 6.72,31.11 5.86,30.25 JP15.2
N$58
  Top 0.152: JP16.1 13.95,23.52 14.61,22.86 40.01,22.86 40.64,22.23 40.64,15.88 41.27,15.24 IC4.16
N$59
  Top 0.152: IC4.15 41.91,16.51 41.27,17.14 41.27,22.86 40.64,23.5 27.94,23.5 27.3,24.13 27.3,27.79 JP17.2
N$60
  Top 0.152: IC4.14 42.55,17.78 41.91,18.41 41.91,23.5 41.27,24.13 36.17,24.13 35.54,24.77 35.54,27.8
N$61  (via drill 0.4)
  Top 0.152: IC4.13 v43.18,19.05
  Bottom 0.152: v43.18,19.05 40.64,19.05 40.01,19.68 40.01,21.59 39.37,22.23 34.29,22.23 33.66,21.59 33.66,18.41 33.02,17.78 17.14,17.78 16.51,18.41 16.51,20.17 JP19.2
N$62  (via drill 0.4)
  Top 0.152: IC4.12 v43.81,20.32 | v32.38,19.68 32.38,19.05 31.75,18.41 25.4,18.41 24.74,19.07 JP20.1
  Bottom 0.152: v43.81,20.32 41.27,20.32 40.64,20.95 40.64,22.23 40.01,22.86 33.02,22.86 32.38,22.23 v32.38,19.68
N$63
  Top 0.152: IC5.13 48.26,10.16 46.67,11.75 42.23,11.75 40.01,9.53 25.4,9.53 24.74,10.18 JP24.1
N$64  (via drill 0.35)
  Top 0.152: IC5.16 43.28,9.42 v43.18,9.53 | v43.18,13.97 42.55,14.61 39.37,14.61 38.09,15.88 JP21.2
  Bottom 0.152: v43.18,13.97 v43.18,9.53
N$65  (via drill 0.35)
  Top 0.152: IC5.15 45.72,10.79 45.09,11.43 42.55,11.43 40.64,9.53 v40.64,8.89 | v40.64,6.35 10.16,6.35 9.53,6.99 9.53,13.34 8.89,13.97 5.88,13.97 JP22.1
  Bottom 0.152: v40.64,6.35 v40.64,8.89
N$66
  Top 0.152: IC5.14 46.99,8.26 46.35,7.62 17.14,7.62 16.49,8.28 JP23.2
N$67
  Top 0.152: IC5.12 49.53,10.16 47.62,12.06 38.23,12.06 JP25.2
N$68
  Top 0.152: IC6.16 76.3,1.37 76.16,1.23 14.65,1.23 13.95,1.93 JP26.1
N$69
  Top 0.152: JP27.2 27.3,4.29 27.3,1.91 27.7,1.51 74.54,1.51 74.93,1.91 74.93,3.17 75.56,3.81 IC6.15
N$70
  Top 0.152: 35.56,2.54 36.28,1.82 74.23,1.82 74.61,2.19 74.61,4.12 75.56,5.08 IC6.14 | 35.54,4.3 35.56,4.28 35.56,2.54 | 35.56,2.54 35.55,2.55 JP28.1
N$71
  Top 0.152: IC6.7 83.82,10.16 84.45,10.79 84.45,12.06 85.31,12.92 FAN_CTRL.1
N$72
  Top 0.508: R1.2 70.58,3.17 67.73,3.17 PWMOUT.1
N$73
  Top 0.508: R2.2 70.54,7.04 69.23,5.73 PWMOUT.2
N$74
  Top 0.508: IC6.11 70.48,8.89 69.85,8.26 67.73,8.26 PWMOUT.3
N$75
  Top 0.508: PWMOUT.4 73.64,10.81 74.3,10.16 IC6.10
N$76
  Top 0.508: PWMGND.1 61.98,3.17 60.87,4.28 R3.1
N$77
  Top 0.508: PWMGND.2 62.12,5.71 60.74,7.09 R4.1
N$80
  Top 0.508: IC6.13 74.93,6.35 73.27,4.69 R1.1
N$81
  Top 0.508: IC6.12 74.93,7.62 74.3,6.99 73.23,6.99 R2.1
VCC  (via drill 0.55)
  Top 0.508: C10.1 55.45,35.56 BYTE3.16 | BYTE1.16 58.4,61.71 C8.1 73.21,63.28 73.66,62.83 BYTE1.10 | 56.28,24.03 56.41,23.89 | C9.1 BYTE2.16
  Top 0.61: BYTE4.16 57.55,23.89 56.41,23.89 C11.1 56.28,23.76 56.28,24.03 56.28,24.6 v55.73,25.15
  Bottom 0.508: BYTE1.16 56.15,60.96 VIN.1 55.88,61.12 55.88,49.82 56.75,48.95 56.7,48.9 | 56.7,48.9 55.24,47.44 55.24,36.83 56.52,35.56 | 56.52,35.56 BYTE3.16 57.78,36.54 59.03,37.79 72.61,37.79 73.03,37.37 BYTE3.10 | VOUT.1 50.34,12.88 51.85,14.39 53.24,14.39 57.78,18.94 BYTE4.16 57.78,24.99 58.86,26.07 72.41,26.07 73.03,25.45 BYTE4.10 | 56.52,35.56 56.52,29.79 56.15,29.43 56.15,26.04 55.73,25.62 v55.73,25.15 | 56.7,48.9 BYTE2.16 57.78,50.4 58.04,50.66 72.68,50.66 73.03,50.32 BYTE2.10

### Text on the board
tNames: SRCLK | RCLK | SER | GND | spare bits | oflw | 32 | 31 | 30 | 29
bNames: Driver circuit for Fetch | Designed by Simen E. Sørensen, 2019
200bmp: C:/Users/Simen/Documents/MEGA/Ferrofluid/YouTube branding/Logo/Workspace/IMG_5789_with_text_bitmap_for_PCB_inverse_mirrored.bmp